# EasyEDA Pro project 64.epro

# Schematic Schematic1
Create Date: 2023-10-18; Page Name: P1; Project Name: 8*8ws2812bdis; Schematic Name: Schematic1; Update Date: 2023-10-18; Company: 嘉立创EDA; Page Size: A4; Version: V1.0
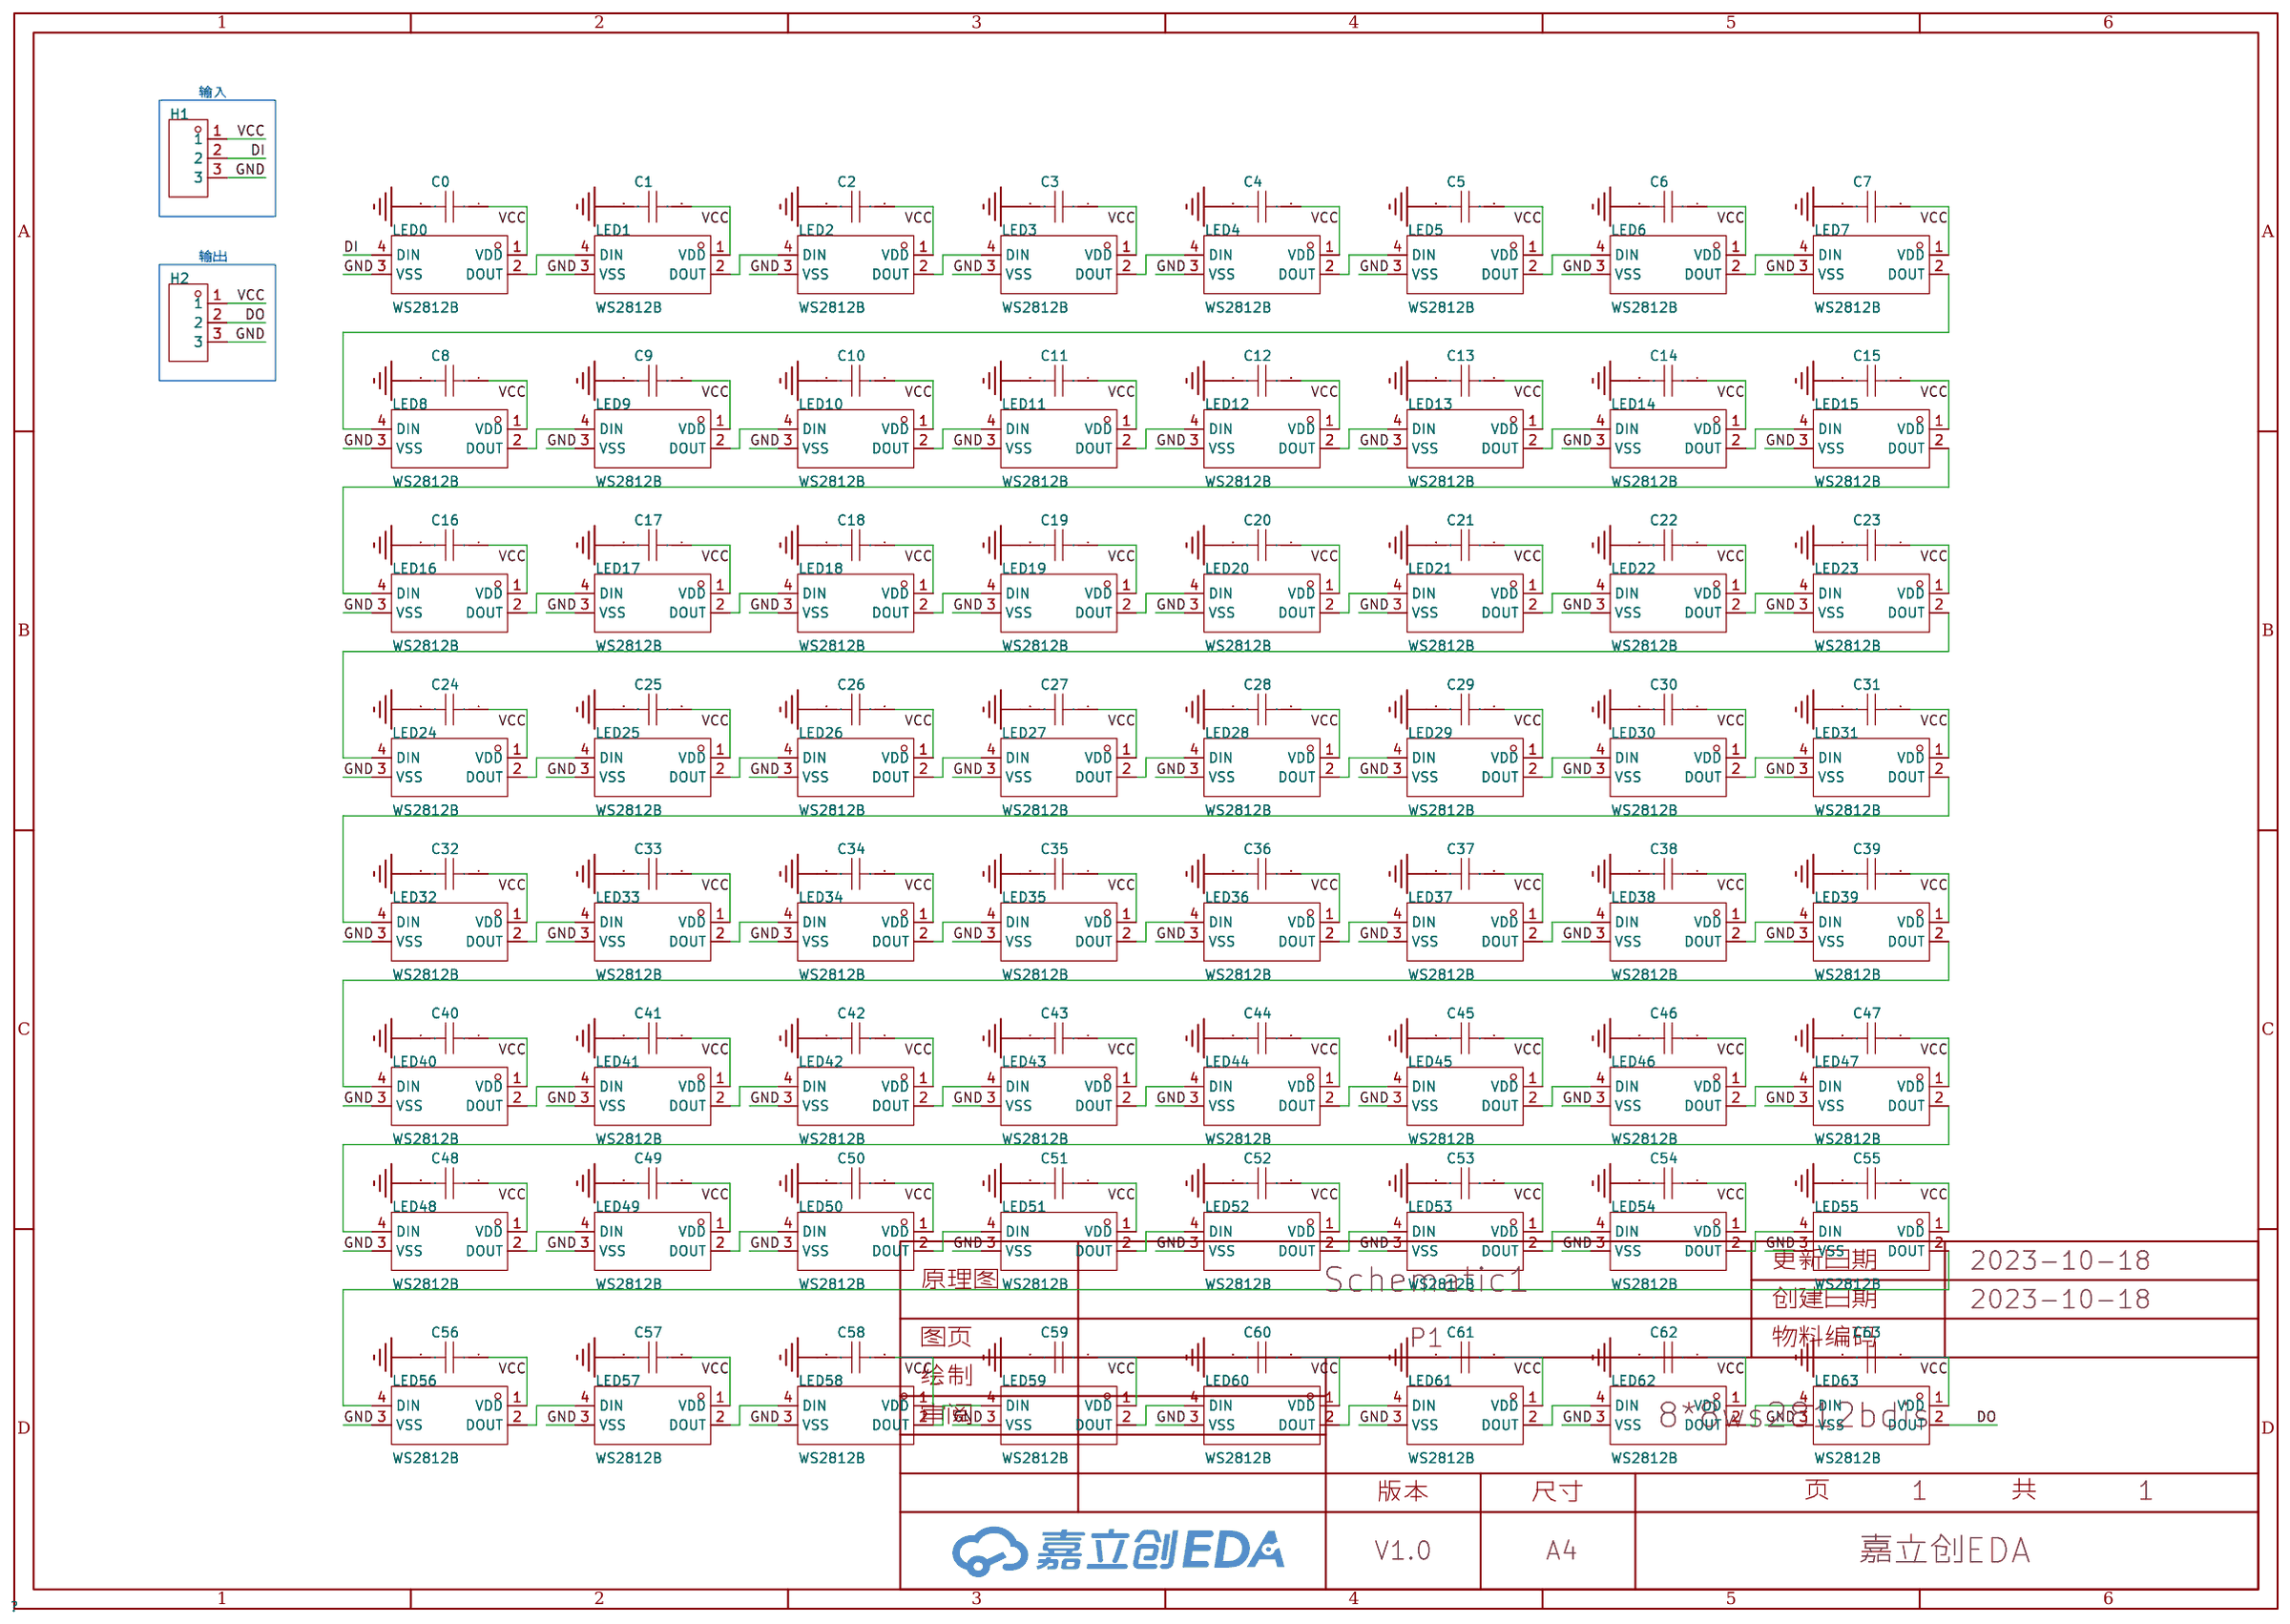
[diagram p0: schematic sheet]

## Parts
C0  0.1uF  [C0603]
C1  0.1uF  [C0603]
C2  0.1uF  [C0603]
C3  0.1uF  [C0603]
C4  0.1uF  [C0603]
C5  0.1uF  [C0603]
C6  0.1uF  [C0603]
C7  0.1uF  [C0603]
C8  0.1uF  [C0603]
C9  0.1uF  [C0603]
C10  0.1uF  [C0603]
C11  0.1uF  [C0603]
C12  0.1uF  [C0603]
C13  0.1uF  [C0603]
C14  0.1uF  [C0603]
C15  0.1uF  [C0603]
C16  0.1uF  [C0603]
C17  0.1uF  [C0603]
C18  0.1uF  [C0603]
C19  0.1uF  [C0603]
C20  0.1uF  [C0603]
C21  0.1uF  [C0603]
C22  0.1uF  [C0603]
C23  0.1uF  [C0603]
C24  0.1uF  [C0603]
C25  0.1uF  [C0603]
C26  0.1uF  [C0603]
C27  0.1uF  [C0603]
C28  0.1uF  [C0603]
C29  0.1uF  [C0603]
C30  0.1uF  [C0603]
C31  0.1uF  [C0603]
C32  0.1uF  [C0603]
C33  0.1uF  [C0603]
C34  0.1uF  [C0603]
C35  0.1uF  [C0603]
C36  0.1uF  [C0603]
C37  0.1uF  [C0603]
C38  0.1uF  [C0603]
C39  0.1uF  [C0603]
C40  0.1uF  [C0603]
C41  0.1uF  [C0603]
C42  0.1uF  [C0603]
C43  0.1uF  [C0603]
C44  0.1uF  [C0603]
C45  0.1uF  [C0603]
C46  0.1uF  [C0603]
C47  0.1uF  [C0603]
C48  0.1uF  [C0603]
C49  0.1uF  [C0603]
C50  0.1uF  [C0603]
C51  0.1uF  [C0603]
C52  0.1uF  [C0603]
C53  0.1uF  [C0603]
C54  0.1uF  [C0603]
C55  0.1uF  [C0603]
C56  0.1uF  [C0603]
C57  0.1uF  [C0603]
C58  0.1uF  [C0603]
C59  0.1uF  [C0603]
C60  0.1uF  [C0603]
C61  0.1uF  [C0603]
C62  0.1uF  [C0603]
C63  0.1uF  [C0603]
H1  -  [HDR-TH_3P-P2.54-V-M]
H2  -  [HDR-TH_3P-P2.54-V-M]
LED0  WS2812B  [LED-SMD_4P-L5.0-W5.0-TL]
LED1  WS2812B  [LED-SMD_4P-L5.0-W5.0-TL]
LED2  WS2812B  [LED-SMD_4P-L5.0-W5.0-TL]
LED3  WS2812B  [LED-SMD_4P-L5.0-W5.0-TL]
LED4  WS2812B  [LED-SMD_4P-L5.0-W5.0-TL]
LED5  WS2812B  [LED-SMD_4P-L5.0-W5.0-TL]
LED6  WS2812B  [LED-SMD_4P-L5.0-W5.0-TL]
LED7  WS2812B  [LED-SMD_4P-L5.0-W5.0-TL]
LED8  WS2812B  [LED-SMD_4P-L5.0-W5.0-TL]
LED9  WS2812B  [LED-SMD_4P-L5.0-W5.0-TL]
LED10  WS2812B  [LED-SMD_4P-L5.0-W5.0-TL]
LED11  WS2812B  [LED-SMD_4P-L5.0-W5.0-TL]
LED12  WS2812B  [LED-SMD_4P-L5.0-W5.0-TL]
LED13  WS2812B  [LED-SMD_4P-L5.0-W5.0-TL]
LED14  WS2812B  [LED-SMD_4P-L5.0-W5.0-TL]
LED15  WS2812B  [LED-SMD_4P-L5.0-W5.0-TL]
LED16  WS2812B  [LED-SMD_4P-L5.0-W5.0-TL]
LED17  WS2812B  [LED-SMD_4P-L5.0-W5.0-TL]
LED18  WS2812B  [LED-SMD_4P-L5.0-W5.0-TL]
LED19  WS2812B  [LED-SMD_4P-L5.0-W5.0-TL]
LED20  WS2812B  [LED-SMD_4P-L5.0-W5.0-TL]
LED21  WS2812B  [LED-SMD_4P-L5.0-W5.0-TL]
LED22  WS2812B  [LED-SMD_4P-L5.0-W5.0-TL]
LED23  WS2812B  [LED-SMD_4P-L5.0-W5.0-TL]
LED24  WS2812B  [LED-SMD_4P-L5.0-W5.0-TL]
LED25  WS2812B  [LED-SMD_4P-L5.0-W5.0-TL]
LED26  WS2812B  [LED-SMD_4P-L5.0-W5.0-TL]
LED27  WS2812B  [LED-SMD_4P-L5.0-W5.0-TL]
LED28  WS2812B  [LED-SMD_4P-L5.0-W5.0-TL]
LED29  WS2812B  [LED-SMD_4P-L5.0-W5.0-TL]
LED30  WS2812B  [LED-SMD_4P-L5.0-W5.0-TL]
LED31  WS2812B  [LED-SMD_4P-L5.0-W5.0-TL]
LED32  WS2812B  [LED-SMD_4P-L5.0-W5.0-TL]
LED33  WS2812B  [LED-SMD_4P-L5.0-W5.0-TL]
LED34  WS2812B  [LED-SMD_4P-L5.0-W5.0-TL]
LED35  WS2812B  [LED-SMD_4P-L5.0-W5.0-TL]
LED36  WS2812B  [LED-SMD_4P-L5.0-W5.0-TL]
LED37  WS2812B  [LED-SMD_4P-L5.0-W5.0-TL]
LED38  WS2812B  [LED-SMD_4P-L5.0-W5.0-TL]
LED39  WS2812B  [LED-SMD_4P-L5.0-W5.0-TL]
LED40  WS2812B  [LED-SMD_4P-L5.0-W5.0-TL]
LED41  WS2812B  [LED-SMD_4P-L5.0-W5.0-TL]
LED42  WS2812B  [LED-SMD_4P-L5.0-W5.0-TL]
LED43  WS2812B  [LED-SMD_4P-L5.0-W5.0-TL]
LED44  WS2812B  [LED-SMD_4P-L5.0-W5.0-TL]
LED45  WS2812B  [LED-SMD_4P-L5.0-W5.0-TL]
LED46  WS2812B  [LED-SMD_4P-L5.0-W5.0-TL]
LED47  WS2812B  [LED-SMD_4P-L5.0-W5.0-TL]
LED48  WS2812B  [LED-SMD_4P-L5.0-W5.0-TL]
LED49  WS2812B  [LED-SMD_4P-L5.0-W5.0-TL]
LED50  WS2812B  [LED-SMD_4P-L5.0-W5.0-TL]
LED51  WS2812B  [LED-SMD_4P-L5.0-W5.0-TL]
LED52  WS2812B  [LED-SMD_4P-L5.0-W5.0-TL]
LED53  WS2812B  [LED-SMD_4P-L5.0-W5.0-TL]
LED54  WS2812B  [LED-SMD_4P-L5.0-W5.0-TL]
LED55  WS2812B  [LED-SMD_4P-L5.0-W5.0-TL]
LED56  WS2812B  [LED-SMD_4P-L5.0-W5.0-TL]
LED57  WS2812B  [LED-SMD_4P-L5.0-W5.0-TL]
LED58  WS2812B  [LED-SMD_4P-L5.0-W5.0-TL]
LED59  WS2812B  [LED-SMD_4P-L5.0-W5.0-TL]
LED60  WS2812B  [LED-SMD_4P-L5.0-W5.0-TL]
LED61  WS2812B  [LED-SMD_4P-L5.0-W5.0-TL]
LED62  WS2812B  [LED-SMD_4P-L5.0-W5.0-TL]
LED63  WS2812B  [LED-SMD_4P-L5.0-W5.0-TL]

## Library data of the parts
C0-C63 = 0603BB104K500NGT: 容值:0.1uF;精度:±10%;额定电压:50V;温度系数:-;; LCSC Part Name: 0.1uF ±10% 50V; Supplier Part: C2168571; Manufacturer: Knowles(楼氏); Supplier Footprint: 0603; JLCPCB Part Class: 扩展库; Datasheet: https://atta.szlcsc.com/upload/public/pdf/source/20210426/55B82DB4A9EC19DEFEE13887341FCC08.pdf; Supplier: LCSC; Tolerance: ±10%; Voltage Rated: 50V
H1 H2 = HDR-M_2.54_1x3P: Supplier Part: C2937625; Supplier Footprint: 插件; JLCPCB Part Class: 扩展库
LED0-LED63 = WS2812B_C9900004137: Supplier Part: C9900004137; Supplier Footprint: LED-4_5050; JLCPCB Part Class: 扩展库; Supplier: LCSC

## Nets
GND: C0.2 C1.2 C2.2 C3.2 C4.2 C5.2 C6.2 C7.2 C8.2 C9.2 C10.2 C11.2 C12.2 C13.2 C14.2 C15.2 C16.2 C17.2 C18.2 C19.2 C20.2 C21.2 C22.2 C23.2 C24.2 C25.2 C26.2 C27.2 C28.2 C29.2 C30.2 C31.2 C32.2 C33.2 C34.2 C35.2 C36.2 C37.2 C38.2 C39.2 C40.2 C41.2 C42.2 C43.2 C44.2 C45.2 C46.2 C47.2 C48.2 C49.2 C50.2 C51.2 C52.2 C53.2 C54.2 C55.2 C56.2 C57.2 C58.2 C59.2 C60.2 C61.2 C62.2 C63.2 H1.3 H2.3 LED0.3(VSS) LED1.3(VSS) LED2.3(VSS) LED3.3(VSS) LED4.3(VSS) LED5.3(VSS) LED6.3(VSS) LED7.3(VSS) LED8.3(VSS) LED9.3(VSS) LED10.3(VSS) LED11.3(VSS) LED12.3(VSS) LED13.3(VSS) LED14.3(VSS) LED15.3(VSS) LED16.3(VSS) LED17.3(VSS) LED18.3(VSS) LED19.3(VSS) LED20.3(VSS) LED21.3(VSS) LED22.3(VSS) LED23.3(VSS) LED24.3(VSS) LED25.3(VSS) LED26.3(VSS) LED27.3(VSS) LED28.3(VSS) LED29.3(VSS) LED30.3(VSS) LED31.3(VSS) LED32.3(VSS) LED33.3(VSS) LED34.3(VSS) LED35.3(VSS) LED36.3(VSS) LED37.3(VSS) LED38.3(VSS) LED39.3(VSS) LED40.3(VSS) LED41.3(VSS) LED42.3(VSS) LED43.3(VSS) LED44.3(VSS) LED45.3(VSS) LED46.3(VSS) LED47.3(VSS) LED48.3(VSS) LED49.3(VSS) LED50.3(VSS) LED51.3(VSS) LED52.3(VSS) LED53.3(VSS) LED54.3(VSS) LED55.3(VSS) LED56.3(VSS) LED57.3(VSS) LED58.3(VSS) LED59.3(VSS) LED60.3(VSS) LED61.3(VSS) LED62.3(VSS) LED63.3(VSS)
VCC: C0.1 C1.1 C2.1 C3.1 C4.1 C5.1 C6.1 C7.1 C8.1 C9.1 C10.1 C11.1 C12.1 C13.1 C14.1 C15.1 C16.1 C17.1 C18.1 C19.1 C20.1 C21.1 C22.1 C23.1 C24.1 C25.1 C26.1 C27.1 C28.1 C29.1 C30.1 C31.1 C32.1 C33.1 C34.1 C35.1 C36.1 C37.1 C38.1 C39.1 C40.1 C41.1 C42.1 C43.1 C44.1 C45.1 C46.1 C47.1 C48.1 C49.1 C50.1 C51.1 C52.1 C53.1 C54.1 C55.1 C56.1 C57.1 C58.1 C59.1 C60.1 C61.1 C62.1 C63.1 H1.1 H2.1 LED0.1(VDD) LED1.1(VDD) LED2.1(VDD) LED3.1(VDD) LED4.1(VDD) LED5.1(VDD) LED6.1(VDD) LED7.1(VDD) LED8.1(VDD) LED9.1(VDD) LED10.1(VDD) LED11.1(VDD) LED12.1(VDD) LED13.1(VDD) LED14.1(VDD) LED15.1(VDD) LED16.1(VDD) LED17.1(VDD) LED18.1(VDD) LED19.1(VDD) LED20.1(VDD) LED21.1(VDD) LED22.1(VDD) LED23.1(VDD) LED24.1(VDD) LED25.1(VDD) LED26.1(VDD) LED27.1(VDD) LED28.1(VDD) LED29.1(VDD) LED30.1(VDD) LED31.1(VDD) LED32.1(VDD) LED33.1(VDD) LED34.1(VDD) LED35.1(VDD) LED36.1(VDD) LED37.1(VDD) LED38.1(VDD) LED39.1(VDD) LED40.1(VDD) LED41.1(VDD) LED42.1(VDD) LED43.1(VDD) LED44.1(VDD) LED45.1(VDD) LED46.1(VDD) LED47.1(VDD) LED48.1(VDD) LED49.1(VDD) LED50.1(VDD) LED51.1(VDD) LED52.1(VDD) LED53.1(VDD) LED54.1(VDD) LED55.1(VDD) LED56.1(VDD) LED57.1(VDD) LED58.1(VDD) LED59.1(VDD) LED60.1(VDD) LED61.1(VDD) LED62.1(VDD) LED63.1(VDD)
DI: H1.2 LED0.4(DIN)
DO: H2.2 LED63.2(DOUT)
Net-(LED0-2): LED0.2(DOUT) LED1.4(DIN)
Net-(LED1-2): LED1.2(DOUT) LED2.4(DIN)
Net-(LED2-2): LED2.2(DOUT) LED3.4(DIN)
Net-(LED3-2): LED3.2(DOUT) LED4.4(DIN)
Net-(LED4-2): LED4.2(DOUT) LED5.4(DIN)
Net-(LED5-2): LED5.2(DOUT) LED6.4(DIN)
Net-(LED6-2): LED6.2(DOUT) LED7.4(DIN)
Net-(LED7-2): LED7.2(DOUT) LED8.4(DIN)
Net-(LED8-2): LED8.2(DOUT) LED9.4(DIN)
Net-(LED9-2): LED9.2(DOUT) LED10.4(DIN)
Net-(LED10-2): LED10.2(DOUT) LED11.4(DIN)
Net-(LED11-2): LED11.2(DOUT) LED12.4(DIN)
Net-(LED12-2): LED12.2(DOUT) LED13.4(DIN)
Net-(LED13-2): LED13.2(DOUT) LED14.4(DIN)
Net-(LED14-2): LED14.2(DOUT) LED15.4(DIN)
Net-(LED15-2): LED15.2(DOUT) LED16.4(DIN)
Net-(LED16-2): LED16.2(DOUT) LED17.4(DIN)
Net-(LED17-2): LED17.2(DOUT) LED18.4(DIN)
Net-(LED18-2): LED18.2(DOUT) LED19.4(DIN)
Net-(LED19-2): LED19.2(DOUT) LED20.4(DIN)
Net-(LED20-2): LED20.2(DOUT) LED21.4(DIN)
Net-(LED21-2): LED21.2(DOUT) LED22.4(DIN)
Net-(LED22-2): LED22.2(DOUT) LED23.4(DIN)
Net-(LED23-2): LED23.2(DOUT) LED24.4(DIN)
Net-(LED24-2): LED24.2(DOUT) LED25.4(DIN)
Net-(LED25-2): LED25.2(DOUT) LED26.4(DIN)
Net-(LED26-2): LED26.2(DOUT) LED27.4(DIN)
Net-(LED27-2): LED27.2(DOUT) LED28.4(DIN)
Net-(LED28-2): LED28.2(DOUT) LED29.4(DIN)
Net-(LED29-2): LED29.2(DOUT) LED30.4(DIN)
Net-(LED30-2): LED30.2(DOUT) LED31.4(DIN)
Net-(LED31-2): LED31.2(DOUT) LED32.4(DIN)
Net-(LED32-2): LED32.2(DOUT) LED33.4(DIN)
Net-(LED33-2): LED33.2(DOUT) LED34.4(DIN)
Net-(LED34-2): LED34.2(DOUT) LED35.4(DIN)
Net-(LED35-2): LED35.2(DOUT) LED36.4(DIN)
Net-(LED36-2): LED36.2(DOUT) LED37.4(DIN)
Net-(LED37-2): LED37.2(DOUT) LED38.4(DIN)
Net-(LED38-2): LED38.2(DOUT) LED39.4(DIN)
Net-(LED39-2): LED39.2(DOUT) LED40.4(DIN)
Net-(LED40-2): LED40.2(DOUT) LED41.4(DIN)
Net-(LED41-2): LED41.2(DOUT) LED42.4(DIN)
Net-(LED42-2): LED42.2(DOUT) LED43.4(DIN)
Net-(LED43-2): LED43.2(DOUT) LED44.4(DIN)
Net-(LED44-2): LED44.2(DOUT) LED45.4(DIN)
Net-(LED45-2): LED45.2(DOUT) LED46.4(DIN)
Net-(LED46-2): LED46.2(DOUT) LED47.4(DIN)
Net-(LED47-2): LED47.2(DOUT) LED48.4(DIN)
Net-(LED48-2): LED48.2(DOUT) LED49.4(DIN)
Net-(LED49-2): LED49.2(DOUT) LED50.4(DIN)
Net-(LED50-2): LED50.2(DOUT) LED51.4(DIN)
Net-(LED51-2): LED51.2(DOUT) LED52.4(DIN)
Net-(LED52-2): LED52.2(DOUT) LED53.4(DIN)
Net-(LED53-2): LED53.2(DOUT) LED54.4(DIN)
Net-(LED54-2): LED54.2(DOUT) LED55.4(DIN)
Net-(LED55-2): LED55.2(DOUT) LED56.4(DIN)
Net-(LED56-2): LED56.2(DOUT) LED57.4(DIN)
Net-(LED57-2): LED57.2(DOUT) LED58.4(DIN)
Net-(LED58-2): LED58.2(DOUT) LED59.4(DIN)
Net-(LED59-2): LED59.2(DOUT) LED60.4(DIN)
Net-(LED60-2): LED60.2(DOUT) LED61.4(DIN)
Net-(LED61-2): LED61.2(DOUT) LED62.4(DIN)
Net-(LED62-2): LED62.2(DOUT) LED63.4(DIN)

## Notes on the sheet
- 输入
- 输出

# Board PCB1_1
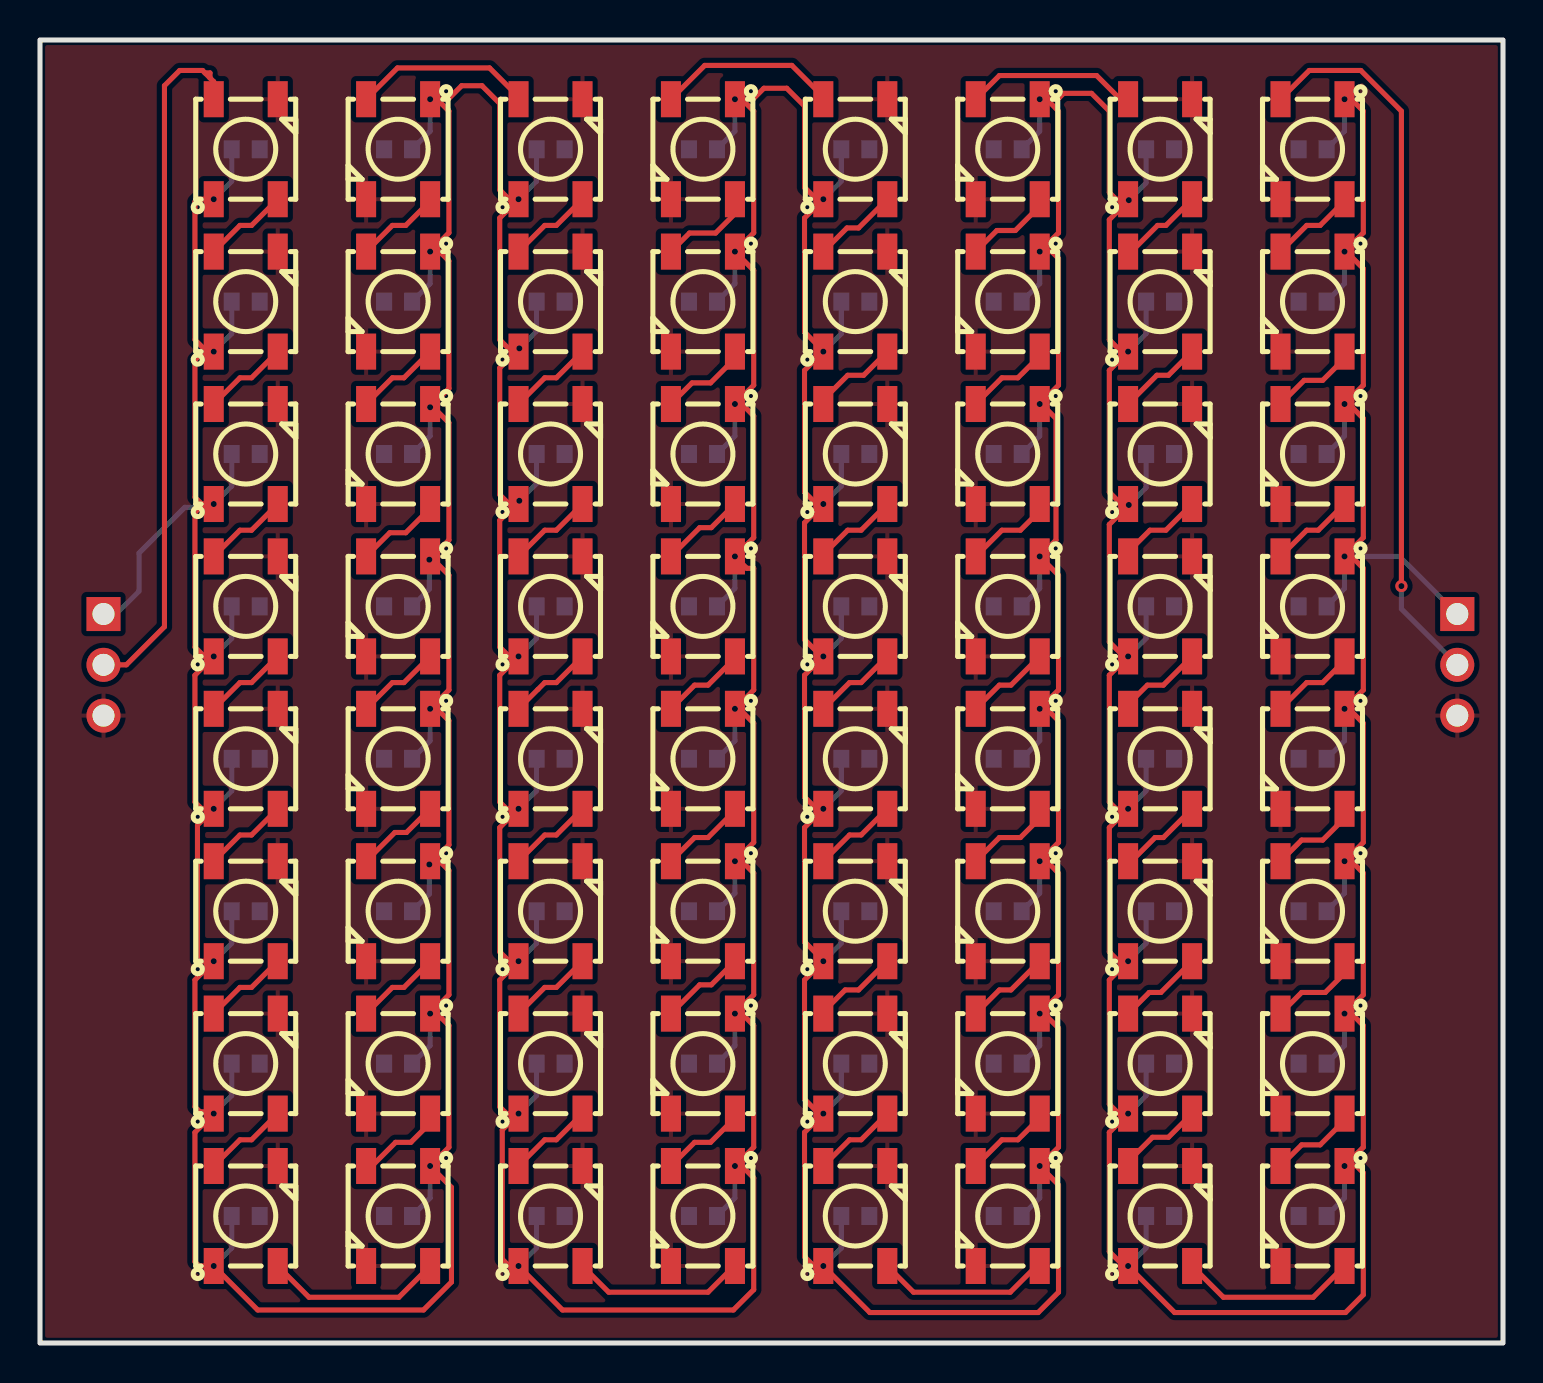
[diagram p1: board, top side]
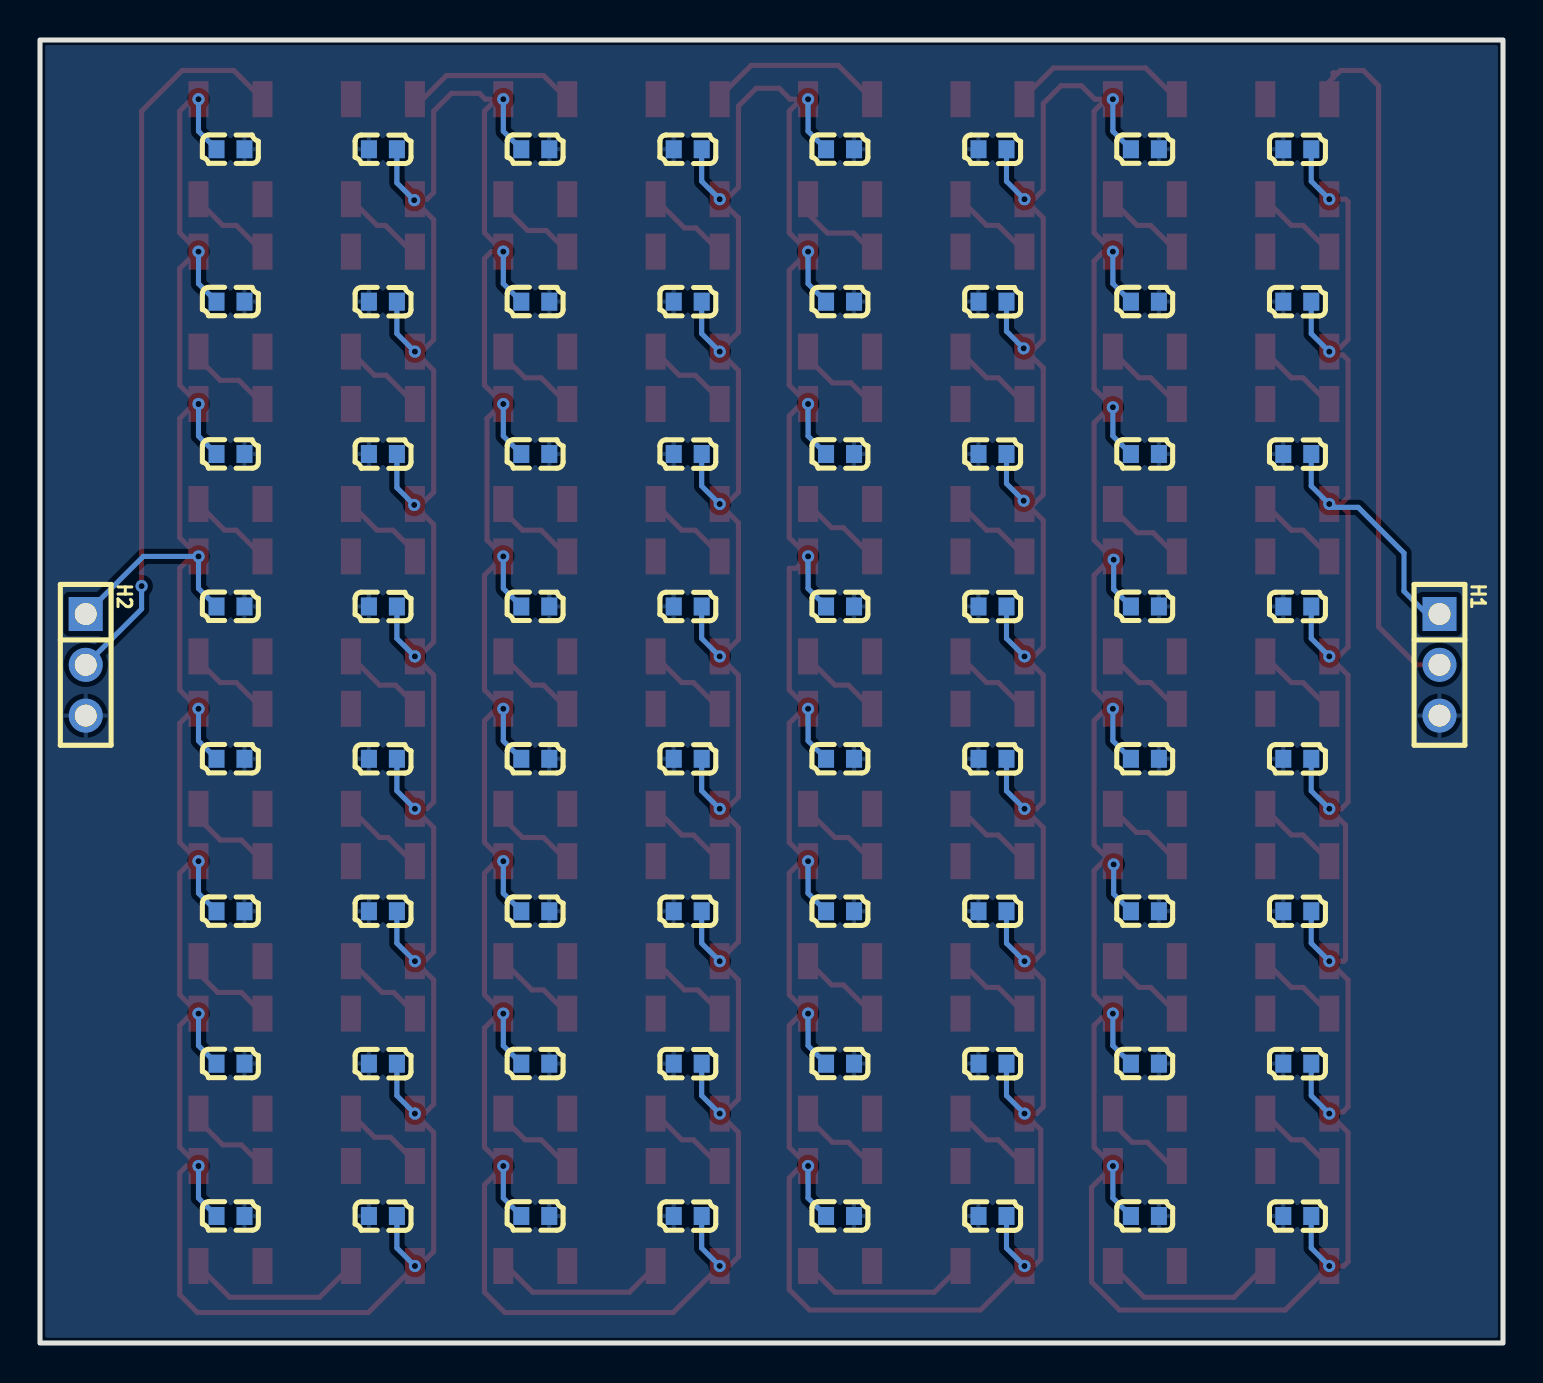
[diagram p2: board, bottom side, seen from below]

Outline 73.15 x 65.15 mm; copper layers: Top Layer, Bottom Layer. Coordinates in mm from the lower left corner of the outline.
Outline path: rectangle 0,65.15 73.15,0
Stack: Top Layer 0.035mm / Dielectric1 1.51mm FR4 er 4.5 / Bottom Layer 0.035mm

## Design rules (mm)
template: JLCPCB Capability(Two Layers Board)
spacing copperThickness1oz (default): track to track 0.102, other pairs 0.152 to 0.3
spacing copperThickness2oz: track to track 0.203, other pairs 0.152 to 0.3
track width copperThickness1oz (default): min 0.127, default 0.254, max 2.54
track width copperThickness2oz: min 0.203, default 0.254, max 2.54
differential pair differentialPair (default): width min 0.127, default 0.254, max 2.54; gap min 0.152, default 0.152
via viaSize (default): diameter min 0.5, default 0.61, max 10; hole min 0.3, default 0.305, max 6.3

## Placement (name value [footprint] x y rotation side)
C0  0.1uF  [C0603]  10.29 6.35 0 bottom
C1  0.1uF  [C0603]  10.29 13.97 0 bottom
C2  0.1uF  [C0603]  10.29 21.59 0 bottom
C3  0.1uF  [C0603]  10.29 29.21 0 bottom
C4  0.1uF  [C0603]  10.29 36.83 0 bottom
C5  0.1uF  [C0603]  10.29 44.45 0 bottom
C6  0.1uF  [C0603]  10.29 59.69 0 bottom
C7  0.1uF  [C0603]  10.29 52.07 0 bottom
C8  0.1uF  [C0603]  17.91 6.35 180 bottom
C9  0.1uF  [C0603]  17.91 13.97 180 bottom
C10  0.1uF  [C0603]  17.91 21.59 180 bottom
C11  0.1uF  [C0603]  17.91 29.21 180 bottom
C12  0.1uF  [C0603]  17.91 36.83 180 bottom
C13  0.1uF  [C0603]  17.91 44.45 180 bottom
C14  0.1uF  [C0603]  17.91 52.07 180 bottom
C15  0.1uF  [C0603]  17.91 59.69 180 bottom
C16  0.1uF  [C0603]  25.53 6.35 0 bottom
C17  0.1uF  [C0603]  25.53 13.97 0 bottom
C18  0.1uF  [C0603]  25.53 21.59 0 bottom
C19  0.1uF  [C0603]  25.53 29.21 0 bottom
C20  0.1uF  [C0603]  25.53 36.83 0 bottom
C21  0.1uF  [C0603]  25.53 44.45 0 bottom
C22  0.1uF  [C0603]  25.53 52.07 0 bottom
C23  0.1uF  [C0603]  25.53 59.69 0 bottom
C24  0.1uF  [C0603]  33.15 36.83 180 bottom
C25  0.1uF  [C0603]  33.15 6.35 180 bottom
C26  0.1uF  [C0603]  33.15 13.97 180 bottom
C27  0.1uF  [C0603]  33.15 21.59 180 bottom
C28  0.1uF  [C0603]  33.15 29.21 180 bottom
C29  0.1uF  [C0603]  33.15 44.45 180 bottom
C30  0.1uF  [C0603]  33.15 52.07 180 bottom
C31  0.1uF  [C0603]  33.15 59.69 180 bottom
C32  0.1uF  [C0603]  40.77 6.35 0 bottom
C33  0.1uF  [C0603]  40.77 13.97 0 bottom
C34  0.1uF  [C0603]  40.77 21.59 0 bottom
C35  0.1uF  [C0603]  40.77 29.21 0 bottom
C36  0.1uF  [C0603]  40.77 36.83 0 bottom
C37  0.1uF  [C0603]  40.77 44.45 0 bottom
C38  0.1uF  [C0603]  40.77 52.07 0 bottom
C39  0.1uF  [C0603]  40.77 59.69 0 bottom
C40  0.1uF  [C0603]  48.39 6.35 180 bottom
C41  0.1uF  [C0603]  48.39 13.97 180 bottom
C42  0.1uF  [C0603]  48.39 21.59 180 bottom
C43  0.1uF  [C0603]  48.39 29.21 180 bottom
C44  0.1uF  [C0603]  48.39 36.83 180 bottom
C45  0.1uF  [C0603]  48.39 44.45 180 bottom
C46  0.1uF  [C0603]  48.39 52.07 180 bottom
C47  0.1uF  [C0603]  48.39 59.69 180 bottom
C48  0.1uF  [C0603]  56.01 6.35 0 bottom
C49  0.1uF  [C0603]  56.01 13.97 0 bottom
C50  0.1uF  [C0603]  56.01 21.59 0 bottom
C51  0.1uF  [C0603]  56.01 29.21 0 bottom
C52  0.1uF  [C0603]  56.01 36.83 0 bottom
C53  0.1uF  [C0603]  56.01 44.45 0 bottom
C54  0.1uF  [C0603]  56.01 52.07 0 bottom
C55  0.1uF  [C0603]  56.01 59.69 0 bottom
C56  0.1uF  [C0603]  63.63 6.35 180 bottom
C57  0.1uF  [C0603]  63.63 13.97 180 bottom
C58  0.1uF  [C0603]  63.63 21.59 180 bottom
C59  0.1uF  [C0603]  63.63 29.21 180 bottom
C60  0.1uF  [C0603]  63.63 36.83 180 bottom
C61  0.1uF  [C0603]  63.63 44.45 180 bottom
C62  0.1uF  [C0603]  63.63 52.07 180 bottom
C63  0.1uF  [C0603]  63.63 59.69 180 bottom
H1  -  [HDR-TH_3P-P2.54-V-M]  3.18 33.91 270 bottom
H2  -  [HDR-TH_3P-P2.54-V-M]  70.87 33.91 270 bottom
LED0  WS2812B  [LED-SMD_4P-L5.0-W5.0-TL]  10.29 59.69 90 top
LED1  WS2812B  [LED-SMD_4P-L5.0-W5.0-TL]  10.29 52.07 90 top
LED2  WS2812B  [LED-SMD_4P-L5.0-W5.0-TL]  10.29 44.45 90 top
LED3  WS2812B  [LED-SMD_4P-L5.0-W5.0-TL]  10.29 36.83 90 top
LED4  WS2812B  [LED-SMD_4P-L5.0-W5.0-TL]  10.29 29.21 90 top
LED5  WS2812B  [LED-SMD_4P-L5.0-W5.0-TL]  10.29 21.59 90 top
LED6  WS2812B  [LED-SMD_4P-L5.0-W5.0-TL]  10.29 13.97 90 top
LED7  WS2812B  [LED-SMD_4P-L5.0-W5.0-TL]  10.29 6.35 90 top
LED8  WS2812B  [LED-SMD_4P-L5.0-W5.0-TL]  17.91 6.35 270 top
LED9  WS2812B  [LED-SMD_4P-L5.0-W5.0-TL]  17.91 13.97 270 top
LED10  WS2812B  [LED-SMD_4P-L5.0-W5.0-TL]  17.91 21.59 270 top
LED11  WS2812B  [LED-SMD_4P-L5.0-W5.0-TL]  17.91 29.21 270 top
LED12  WS2812B  [LED-SMD_4P-L5.0-W5.0-TL]  17.91 36.83 270 top
LED13  WS2812B  [LED-SMD_4P-L5.0-W5.0-TL]  17.91 44.45 270 top
LED14  WS2812B  [LED-SMD_4P-L5.0-W5.0-TL]  17.91 52.07 270 top
LED15  WS2812B  [LED-SMD_4P-L5.0-W5.0-TL]  17.91 59.69 270 top
LED16  WS2812B  [LED-SMD_4P-L5.0-W5.0-TL]  25.53 59.69 90 top
LED17  WS2812B  [LED-SMD_4P-L5.0-W5.0-TL]  25.53 52.07 90 top
LED18  WS2812B  [LED-SMD_4P-L5.0-W5.0-TL]  25.53 44.45 90 top
LED19  WS2812B  [LED-SMD_4P-L5.0-W5.0-TL]  25.53 36.83 90 top
LED20  WS2812B  [LED-SMD_4P-L5.0-W5.0-TL]  25.53 29.21 90 top
LED21  WS2812B  [LED-SMD_4P-L5.0-W5.0-TL]  25.53 21.59 90 top
LED22  WS2812B  [LED-SMD_4P-L5.0-W5.0-TL]  25.53 13.97 90 top
LED23  WS2812B  [LED-SMD_4P-L5.0-W5.0-TL]  25.53 6.35 90 top
LED24  WS2812B  [LED-SMD_4P-L5.0-W5.0-TL]  33.15 6.35 270 top
LED25  WS2812B  [LED-SMD_4P-L5.0-W5.0-TL]  33.15 13.97 270 top
LED26  WS2812B  [LED-SMD_4P-L5.0-W5.0-TL]  33.15 21.59 270 top
LED27  WS2812B  [LED-SMD_4P-L5.0-W5.0-TL]  33.15 29.21 270 top
LED28  WS2812B  [LED-SMD_4P-L5.0-W5.0-TL]  33.15 36.83 270 top
LED29  WS2812B  [LED-SMD_4P-L5.0-W5.0-TL]  33.15 44.45 270 top
LED30  WS2812B  [LED-SMD_4P-L5.0-W5.0-TL]  33.15 52.07 270 top
LED31  WS2812B  [LED-SMD_4P-L5.0-W5.0-TL]  33.15 59.69 270 top
LED32  WS2812B  [LED-SMD_4P-L5.0-W5.0-TL]  40.77 59.69 90 top
LED33  WS2812B  [LED-SMD_4P-L5.0-W5.0-TL]  40.77 52.07 90 top
LED34  WS2812B  [LED-SMD_4P-L5.0-W5.0-TL]  40.77 44.45 90 top
LED35  WS2812B  [LED-SMD_4P-L5.0-W5.0-TL]  40.77 36.83 90 top
LED36  WS2812B  [LED-SMD_4P-L5.0-W5.0-TL]  40.77 29.21 90 top
LED37  WS2812B  [LED-SMD_4P-L5.0-W5.0-TL]  40.77 21.59 90 top
LED38  WS2812B  [LED-SMD_4P-L5.0-W5.0-TL]  40.77 13.97 90 top
LED39  WS2812B  [LED-SMD_4P-L5.0-W5.0-TL]  40.77 6.35 90 top
LED40  WS2812B  [LED-SMD_4P-L5.0-W5.0-TL]  48.39 6.35 270 top
LED41  WS2812B  [LED-SMD_4P-L5.0-W5.0-TL]  48.39 13.97 270 top
LED42  WS2812B  [LED-SMD_4P-L5.0-W5.0-TL]  48.39 21.59 270 top
LED43  WS2812B  [LED-SMD_4P-L5.0-W5.0-TL]  48.39 29.21 270 top
LED44  WS2812B  [LED-SMD_4P-L5.0-W5.0-TL]  48.39 36.83 270 top
LED45  WS2812B  [LED-SMD_4P-L5.0-W5.0-TL]  48.39 44.45 270 top
LED46  WS2812B  [LED-SMD_4P-L5.0-W5.0-TL]  48.39 52.07 270 top
LED47  WS2812B  [LED-SMD_4P-L5.0-W5.0-TL]  48.39 59.69 270 top
LED48  WS2812B  [LED-SMD_4P-L5.0-W5.0-TL]  56.01 59.69 90 top
LED49  WS2812B  [LED-SMD_4P-L5.0-W5.0-TL]  56.01 52.07 90 top
LED50  WS2812B  [LED-SMD_4P-L5.0-W5.0-TL]  56.01 44.45 90 top
LED51  WS2812B  [LED-SMD_4P-L5.0-W5.0-TL]  56.01 36.83 90 top
LED52  WS2812B  [LED-SMD_4P-L5.0-W5.0-TL]  56.01 29.21 90 top
LED53  WS2812B  [LED-SMD_4P-L5.0-W5.0-TL]  56.01 21.59 90 top
LED54  WS2812B  [LED-SMD_4P-L5.0-W5.0-TL]  56.01 13.97 90 top
LED55  WS2812B  [LED-SMD_4P-L5.0-W5.0-TL]  56.01 6.35 90 top
LED56  WS2812B  [LED-SMD_4P-L5.0-W5.0-TL]  63.63 6.35 270 top
LED57  WS2812B  [LED-SMD_4P-L5.0-W5.0-TL]  63.63 13.97 270 top
LED58  WS2812B  [LED-SMD_4P-L5.0-W5.0-TL]  63.63 21.59 270 top
LED59  WS2812B  [LED-SMD_4P-L5.0-W5.0-TL]  63.63 29.21 270 top
LED60  WS2812B  [LED-SMD_4P-L5.0-W5.0-TL]  63.63 36.83 270 top
LED61  WS2812B  [LED-SMD_4P-L5.0-W5.0-TL]  63.63 44.45 270 top
LED62  WS2812B  [LED-SMD_4P-L5.0-W5.0-TL]  63.63 52.07 270 top
LED63  WS2812B  [LED-SMD_4P-L5.0-W5.0-TL]  63.63 59.69 270 top

## Footprints (pads in the part's own frame, mm; a bottom-side part is the same pattern mirrored in y, then rotated)
C0603
  rect 0.8x0.9 smd: 1(-0.7,0) 2(0.7,0)
HDR-TH_3P-P2.54-V-M
  rect 1.7x1.7 hole 1.1: 1(-2.54,0)
  round 1.7 hole 1.1: 2(0,0) 3(2.54,0)
LED-SMD_4P-L5.0-W5.0-TL
  rect 1.8x1 smd: 1(-2.5,1.6) 2(-2.5,-1.6) 3(2.5,-1.6) 4(2.5,1.6)

## Nets
GND: C0.2 C1.2 C2.2 C3.2 C4.2 C5.2 C6.2 C7.2 C8.2 C9.2 C10.2 C11.2 C12.2 C13.2 C14.2 C15.2 C16.2 C17.2 C18.2 C19.2 C20.2 C21.2 C22.2 C23.2 C24.2 C25.2 C26.2 C27.2 C28.2 C29.2 C30.2 C31.2 C32.2 C33.2 C34.2 C35.2 C36.2 C37.2 C38.2 C39.2 C40.2 C41.2 C42.2 C43.2 C44.2 C45.2 C46.2 C47.2 C48.2 C49.2 C50.2 C51.2 C52.2 C53.2 C54.2 C55.2 C56.2 C57.2 C58.2 C59.2 C60.2 C61.2 C62.2 C63.2 H1.3 H2.3 LED0.3 LED1.3 LED2.3 LED3.3 LED4.3 LED5.3 LED6.3 LED7.3 LED8.3 LED9.3 LED10.3 LED11.3 LED12.3 LED13.3 LED14.3 LED15.3 LED16.3 LED17.3 LED18.3 LED19.3 LED20.3 LED21.3 LED22.3 LED23.3 LED24.3 LED25.3 LED26.3 LED27.3 LED28.3 LED29.3 LED30.3 LED31.3 LED32.3 LED33.3 LED34.3 LED35.3 LED36.3 LED37.3 LED38.3 LED39.3 LED40.3 LED41.3 LED42.3 LED43.3 LED44.3 LED45.3 LED46.3 LED47.3 LED48.3 LED49.3 LED50.3 LED51.3 LED52.3 LED53.3 LED54.3 LED55.3 LED56.3 LED57.3 LED58.3 LED59.3 LED60.3 LED61.3 LED62.3 LED63.3
VCC: C0.1 C1.1 C2.1 C3.1 C4.1 C5.1 C6.1 C7.1 C8.1 C9.1 C10.1 C11.1 C12.1 C13.1 C14.1 C15.1 C16.1 C17.1 C18.1 C19.1 C20.1 C21.1 C22.1 C23.1 C24.1 C25.1 C26.1 C27.1 C28.1 C29.1 C30.1 C31.1 C32.1 C33.1 C34.1 C35.1 C36.1 C37.1 C38.1 C39.1 C40.1 C41.1 C42.1 C43.1 C44.1 C45.1 C46.1 C47.1 C48.1 C49.1 C50.1 C51.1 C52.1 C53.1 C54.1 C55.1 C56.1 C57.1 C58.1 C59.1 C60.1 C61.1 C62.1 C63.1 H1.1 H2.1 LED0.1 LED1.1 LED2.1 LED3.1 LED4.1 LED5.1 LED6.1 LED7.1 LED8.1 LED9.1 LED10.1 LED11.1 LED12.1 LED13.1 LED14.1 LED15.1 LED16.1 LED17.1 LED18.1 LED19.1 LED20.1 LED21.1 LED22.1 LED23.1 LED24.1 LED25.1 LED26.1 LED27.1 LED28.1 LED29.1 LED30.1 LED31.1 LED32.1 LED33.1 LED34.1 LED35.1 LED36.1 LED37.1 LED38.1 LED39.1 LED40.1 LED41.1 LED42.1 LED43.1 LED44.1 LED45.1 LED46.1 LED47.1 LED48.1 LED49.1 LED50.1 LED51.1 LED52.1 LED53.1 LED54.1 LED55.1 LED56.1 LED57.1 LED58.1 LED59.1 LED60.1 LED61.1 LED62.1 LED63.1
DI: H1.2 LED0.4
DO: H2.2 LED63.2
$1N808: LED0.2 LED1.4
$1N911: LED1.2 LED2.4
$1N1014: LED2.2 LED3.4
$1N1399: LED3.2 LED4.4
$1N1408: LED4.2 LED5.4
$1N1417: LED5.2 LED6.4
$1N1426: LED6.2 LED7.4
$1N2109: LED8.2 LED9.4
$1N2122: LED9.2 LED10.4
$1N2135: LED10.2 LED11.4
$1N2175: LED11.2 LED12.4
$1N2179: LED12.2 LED13.4
$1N2183: LED13.2 LED14.4
$1N2187: LED14.2 LED15.4
$1N2875: LED16.2 LED17.4
$1N2888: LED17.2 LED18.4
$1N2901: LED18.2 LED19.4
$1N2941: LED19.2 LED20.4
$1N2945: LED20.2 LED21.4
$1N2949: LED21.2 LED22.4
$1N2953: LED22.2 LED23.4
$1N3641: LED24.2 LED25.4
$1N3654: LED25.2 LED26.4
$1N3667: LED26.2 LED27.4
$1N3707: LED27.2 LED28.4
$1N3711: LED28.2 LED29.4
$1N3715: LED29.2 LED30.4
$1N3719: LED30.2 LED31.4
$1N4407: LED32.2 LED33.4
$1N4420: LED33.2 LED34.4
$1N4433: LED34.2 LED35.4
$1N4473: LED35.2 LED36.4
$1N4477: LED36.2 LED37.4
$1N4481: LED37.2 LED38.4
$1N4485: LED38.2 LED39.4
$1N5173: LED40.2 LED41.4
$1N5186: LED41.2 LED42.4
$1N5199: LED42.2 LED43.4
$1N5239: LED43.2 LED44.4
$1N5243: LED44.2 LED45.4
$1N5247: LED45.2 LED46.4
$1N5251: LED46.2 LED47.4
$1N5939: LED48.2 LED49.4
$1N5952: LED49.2 LED50.4
$1N5965: LED50.2 LED51.4
$1N6005: LED51.2 LED52.4
$1N6009: LED52.2 LED53.4
$1N6013: LED53.2 LED54.4
$1N6017: LED54.2 LED55.4
$1N6705: LED56.2 LED57.4
$1N6718: LED57.2 LED58.4
$1N6731: LED58.2 LED59.4
$1N6771: LED59.2 LED60.4
$1N6775: LED60.2 LED61.4
$1N6779: LED61.2 LED62.4
$1N6783: LED62.2 LED63.4
$1N6797: LED7.2 LED8.4
$1N6803: LED15.2 LED16.4
$1N6809: LED23.2 LED24.4
$1N6815: LED31.2 LED32.4
$1N6821: LED39.2 LED40.4
$1N6832: LED47.2 LED48.4
$1N6838: LED55.2 LED56.4

## Via types
v1: diameter 0.61, hole 0.305, Top Layer to Bottom Layer, 65 vias

## Routing (per net, layer and track width the routed paths; a pad name or vN(x,y) marks a point on that pad's centre or on a via; arc(x,y) is an arc through that point)
VCC: length 788.6
  Top Layer w0.254: 23.8,49.57 LED17.1 ; 23.8,49.57 23.58,49.57 22.99,50.16 22.99,56.25 v1(23.93,57.19) 23.46,57.19 22.99,57.66 22.99,61.98 22.1,62.86 21.08,62.86 20.41,62.19 19.85,62.19 ; 23.8,49.57 22.99,48.75 22.99,42.42 23.46,41.95 23.8,41.95 ; 23.8,49.57 v1(23.97,49.73) ; 35.09,62.19 35.69,61.59 35.69,55.51 v1(34.75,54.57) 35.69,53.63 35.69,47.89 v1(34.75,46.95) 35.09,46.95 35.69,46.36 35.69,40.27 v1(34.75,39.33) 35.34,38.73 35.69,38.73 35.69,32.65 v1(34.75,31.71) 34.97,31.71 35.69,30.99 35.69,25.03 v1(34.75,24.09) 35.09,24.09 35.69,23.5 35.69,17.41 v1(34.75,16.47) 35.09,16.47 35.69,15.88 35.69,9.79 v1(34.75,8.85) 35.09,8.85 35.69,8.25 35.69,2.67 34.67,1.65 26.13,1.65 v1(23.93,3.85) 23.46,3.85 23.11,4.19 23.11,10.66 v1(23.93,11.47) 23.33,11.47 22.99,11.81 22.99,18.15 v1(23.93,19.09) 23.46,19.09 22.99,19.56 22.99,25.77 v1(23.93,26.71) 23.33,26.71 22.99,27.05 22.99,33.39 v1(23.93,34.33) 23.46,34.33 22.99,34.8 22.99,41.13 23.8,41.95 ; 35.09,62.19 v1(34.75,62.19) ; 35.09,62.19 35.65,62.19 36.19,62.74 37.34,62.74 38.23,61.85 38.23,57.78 38.82,57.19 v1(39.17,57.19) 38.23,56.25 38.23,50.55 39.17,49.61 v1(39.17,49.57) 38.23,48.63 38.23,42.55 38.82,41.95 v1(39.17,41.95) 38.23,41.01 38.23,35.18 39.08,34.33 v1(39.17,34.33) 38.23,33.39 38.23,27.3 38.82,26.71 v1(39.17,26.71) 38.23,25.77 38.23,20.07 39.17,19.13 v1(39.17,19.09) 38.23,18.15 38.23,12.19 38.95,11.47 v1(39.17,11.47) 38.23,10.53 38.23,4.32 38.69,3.85 v1(39.17,3.85) 41.49,1.52 49.91,1.52 50.93,2.54 50.93,7.91 v1(49.99,8.85) 50.93,9.79 50.93,15.75 50.21,16.47 v1(49.99,16.47) 50.93,17.41 50.93,23.5 50.33,24.09 v1(49.99,24.09) 50.93,25.03 50.93,31.11 50.33,31.71 v1(49.99,31.71) 50.93,32.65 50.93,38.39 v1(49.99,39.33) 50.8,40.14 50.8,46.23 50.08,46.95 v1(49.99,46.95) 50.93,47.89 50.93,54.23 50.59,54.57 v1(49.99,54.57) 50.93,55.51 50.93,61.59 50.33,62.19 ; 23.8,41.95 v1(23.97,42.11) ; 23.8,41.95 LED18.1 ; 19.57,39.27 20.45,40.15 20.45,46.01 19.59,46.87 ; 19.57,39.27 20.45,38.39 20.45,32.65 v1(19.51,31.71) 19.85,31.71 20.45,31.11 20.45,24.91 19.63,24.09 ; 19.57,39.27 LED12.1 ; 19.57,39.27 v1(19.47,39.17) ; v1(19.51,46.79) 19.59,46.87 ; 19.59,46.87 LED13.1 ; 19.59,46.87 20.45,47.73 20.45,54.1 19.98,54.57 v1(19.51,54.57) 20.45,55.51 20.45,61.59 19.85,62.19 ; LED48.1 53.81,57.19 53.47,57.53 53.47,61.59 52.58,62.48 51.18,62.48 50.89,62.19 50.33,62.19 ; v1(54.44,41.9) 53.47,40.93 53.47,35.05 54.19,34.33 v1(54.41,34.33) 53.47,33.39 53.47,27.05 53.81,26.71 v1(54.41,26.71) 53.47,25.77 53.47,19.56 53.94,19.09 v1(54.41,19.09) 53.47,18.15 53.47,11.94 53.94,11.47 v1(54.41,11.47) 53.47,10.53 53.47,4.57 54.19,3.85 v1(54.41,3.85) 56.73,1.52 65.28,1.52 66.17,2.41 66.17,8.51 65.83,8.85 v1(65.23,8.85) 66.17,9.79 66.17,15.88 65.57,16.47 v1(65.23,16.47) 66.17,17.41 66.17,23.5 65.57,24.09 v1(65.23,24.09) 66.17,25.03 66.17,30.99 65.44,31.71 v1(65.23,31.71) 66.17,32.65 66.17,38.73 65.57,39.33 v1(65.23,39.33) 66.17,40.27 66.17,46.23 65.44,46.95 v1(65.23,46.95) 66.17,47.89 66.17,53.72 65.32,54.57 v1(65.23,54.57) 66.17,55.51 66.17,61.59 65.57,62.19 v1(65.23,62.19) ; 19.85,62.19 v1(19.51,62.19) ; 50.33,62.19 v1(49.99,62.19) ; v1(54.44,57.14) 53.47,56.17 53.47,50.16 54.06,49.57 v1(54.41,49.57) 53.47,48.63 53.47,42.55 54.06,41.95 LED50.1 ; 19.63,24.09 LED10.1 ; 19.63,24.09 v1(19.47,23.93) ; 19.63,24.09 19.98,24.09 20.45,23.62 20.45,17.41 v1(19.51,16.47) 19.72,16.26 20.07,16.26 20.45,15.88 20.45,9.79 v1(19.51,8.85) 20.57,7.78 20.57,3.05 19.18,1.65 10.89,1.65 v1(8.69,3.85) 7.96,3.85 7.75,4.06 7.75,10.53 v1(8.69,11.47) 8.6,11.56 8,11.56 7.75,11.81 7.75,18.15 v1(8.69,19.09) 7.96,19.09 7.87,19.18 7.87,25.9 v1(8.69,26.71) 8.09,26.71 7.75,27.05 7.75,33.39 v1(8.69,34.33) 8.22,34.33 7.75,34.8 7.75,41.53 8,41.78 8.52,41.78 v1(8.69,41.95) 8.09,41.95 7.75,42.29 7.75,49.15 8,49.4 8.52,49.4 v1(8.69,49.57) 8.34,49.57 7.75,50.16 7.75,57.06 7.87,57.19 v1(8.69,57.19)
  Bottom Layer w0.254: v1(49.99,62.19) 49.99,60.59 C47.1 ; v1(49.99,16.47) 49.99,14.87 C41.1 ; v1(54.41,3.85) 55.31,4.75 C48.1 ; v1(65.23,16.47) 65.23,14.87 C57.1 ; v1(23.93,3.85) 24.83,4.75 C16.1 ; C36.1 40.07,35.23 v1(39.17,34.33) ; C56.1 65.23,7.25 v1(65.23,8.85) ; v1(34.75,24.09) 34.75,22.49 C27.1 ; v1(54.44,57.14) 55.31,58.01 C55.1 ; C58.1 65.23,22.49 v1(65.23,24.09) ; C22.1 24.83,50.59 v1(23.97,49.73) ; C43.1 49.99,30.11 v1(49.99,31.71) ; v1(34.75,8.85) 34.75,7.25 C25.1 ; v1(8.69,26.71) 9.59,27.61 C3.1 ; C42.1 49.99,22.49 v1(49.99,24.09) ; C60.1 65.23,37.73 v1(65.23,39.33) 67.99,39.33 H2.1 ; C28.1 34.75,30.11 v1(34.75,31.71) ; v1(19.47,39.17) 19.47,37.69 C12.1 ; C1.1 9.59,12.37 v1(8.69,11.47) ; C10.1 19.47,22.45 v1(19.47,23.93) ; v1(49.99,39.33) 49.99,37.73 C44.1 ; C62.1 65.23,52.97 v1(65.23,54.57) ; C4.1 9.59,35.23 v1(8.69,34.33) ; C61.1 65.23,45.35 v1(65.23,46.95) ; v1(19.51,62.19) 19.51,60.59 C15.1 ; v1(19.51,16.47) 19.51,14.87 C9.1 ; v1(49.99,46.95) 49.99,45.35 C45.1 ; C19.1 24.83,27.61 v1(23.93,26.71) ; C39.1 40.07,58.09 v1(39.17,57.19) ; v1(49.99,54.57) 49.99,52.97 C46.1 ; v1(65.23,31.71) 65.23,30.11 C59.1 ; v1(39.17,19.09) 40.07,19.99 C34.1 ; v1(39.17,49.57) 40.07,50.47 C38.1 ; v1(23.93,34.33) 24.83,35.23 C20.1 ; v1(19.51,54.57) 19.51,52.97 C14.1 ; C52.1 55.31,35.23 v1(54.41,34.33) ; v1(19.51,8.85) 19.51,7.25 C8.1 ; C35.1 40.07,27.61 v1(39.17,26.71) ; C23.1 24.83,58.09 v1(23.93,57.19) ; v1(49.99,8.85) 49.99,7.25 C40.1 ; v1(19.51,31.71) 19.51,30.11 C11.1 ; C17.1 24.83,12.37 v1(23.93,11.47) ; C26.1 34.75,14.87 v1(34.75,16.47) ; C33.1 40.07,12.37 v1(39.17,11.47) ; v1(34.75,54.57) 34.75,52.97 C30.1 ; v1(8.69,57.19) 9.59,58.09 C6.1 ; v1(39.17,3.85) 40.07,4.75 C32.1 ; C63.1 65.23,60.59 v1(65.23,62.19) ; C21.1 24.83,42.97 v1(23.97,42.11) ; v1(54.44,41.9) 55.31,42.77 C53.1 ; H1.1 3.81,36.45 4.95,37.59 4.95,39.5 7.24,41.78 8.52,41.78 v1(8.69,41.95) 9.59,42.85 C5.1 ; C29.1 34.75,45.35 v1(34.75,46.95) ; v1(34.75,39.33) 34.75,37.73 C24.1 ; C18.1 24.83,19.99 v1(23.93,19.09) ; v1(54.41,26.71) 55.31,27.61 C51.1 ; C49.1 55.31,12.37 v1(54.41,11.47) ; C0.1 9.59,4.75 v1(8.69,3.85) ; v1(34.75,62.19) 34.75,60.59 C31.1 ; v1(39.17,41.95) 40.07,42.85 C37.1 ; C50.1 55.31,19.99 v1(54.41,19.09) ; v1(54.41,49.57) 55.31,50.47 C54.1 ; C7.1 9.59,50.47 v1(8.69,49.57) ; v1(8.69,19.09) 9.59,19.99 C2.1 ; C13.1 19.51,45.35 v1(19.51,46.79)
DI: length 35.3
  Top Layer w0.254: 8.25,63.5 8.13,63.63 6.98,63.63 6.22,62.86 6.22,35.81 4.32,33.91 H1.2 ; 8.25,63.5 8.5,63.26 ; 8.25,63.5 8.5,63.5 8.5,63.26 ; LED0.4 8.69,63.07 8.5,63.26
DO: length 36.3
  Top Layer w0.254: v1(68.07,37.85) 68.07,61.59 66.04,63.63 63.46,63.63 LED63.2
  Bottom Layer w0.254: v1(68.07,37.85) 68.07,36.7 H2.2
$1N808: length 4.3
  Top Layer w0.254: LED0.2 10.58,55.88 10,55.88 LED1.4
$1N911: length 4.3
  Top Layer w0.254: LED1.2 10.58,48.26 10,48.26 LED2.4
$1N1014: length 4.3
  Top Layer w0.254: LED2.2 10.58,40.64 10,40.64 LED3.4
$1N1399: length 4.3
  Top Layer w0.254: LED4.4 10,33.02 10.58,33.02 LED3.2
$1N1408: length 4.3
  Top Layer w0.254: LED4.2 10.58,25.4 10,25.4 LED5.4
$1N1417: length 4.3
  Top Layer w0.254: LED5.2 10.58,17.78 10,17.78 LED6.4
$1N1426: length 4.3
  Top Layer w0.254: LED7.4 10,10.16 10.58,10.16 LED6.2
$1N2109: length 4.6
  Top Layer w0.254: LED9.4 19.51,11 18.54,10.03 17.78,10.03 16.6,8.85 LED8.2
$1N2122: length 4.3
  Top Layer w0.254: LED9.2 17.62,17.78 18.2,17.78 LED10.4
$1N2135: length 4.3
  Top Layer w0.254: LED10.2 17.74,25.53 18.32,25.53 LED11.4
$1N2175: length 4.3
  Top Layer w0.254: LED12.4 18.2,33.02 17.62,33.02 LED11.2
$1N2179: length 4.4
  Top Layer w0.254: LED13.4 19.51,41.73 18.29,40.51 17.49,40.51 LED12.2
$1N2183: length 4.3
  Top Layer w0.254: LED13.2 17.62,48.26 18.2,48.26 LED14.4
$1N2187: length 4.3
  Top Layer w0.254: LED14.2 17.62,55.88 18.29,55.88 19.51,57.1 LED15.4
$1N2875: length 4.3
  Top Layer w0.254: LED17.4 25.24,55.88 25.82,55.88 LED16.2
$1N2888: length 4.3
  Top Layer w0.254: LED17.2 25.82,48.26 25.24,48.26 LED18.4
$1N2901: length 4.3
  Top Layer w0.254: LED18.2 25.82,40.64 25.24,40.64 LED19.4
$1N2941: length 4.3
  Top Layer w0.254: LED20.4 25.24,33.02 25.82,33.02 LED19.2
$1N2945: length 4.3
  Top Layer w0.254: LED21.4 25.24,25.4 25.82,25.4 LED20.2
$1N2949: length 4.3
  Top Layer w0.254: LED21.2 25.82,17.78 25.24,17.78 LED22.4
$1N2953: length 4.3
  Top Layer w0.254: LED22.2 25.82,10.16 25.24,10.16 LED23.4
$1N3641: length 4.4
  Top Layer w0.254: LED25.4 34.75,11.25 33.53,10.03 32.73,10.03 LED24.2
$1N3654: length 4.3
  Top Layer w0.254: LED25.2 32.98,17.91 33.56,17.91 LED26.4
$1N3667: length 4.3
  Top Layer w0.254: LED26.2 32.73,25.27 33.4,25.27 34.75,26.62 LED27.4
$1N3707: length 4.3
  Top Layer w0.254: LED27.2 32.73,32.89 33.4,32.89 34.75,34.24 LED28.4
$1N3711: length 4.3
  Top Layer w0.254: LED28.2 32.98,40.77 33.56,40.77 LED29.4
$1N3715: length 4.5
  Top Layer w0.254: LED29.2 32.6,48.01 33.53,48.01 34.75,49.22 LED30.4
$1N3719: length 4.7
  Top Layer w0.254: LED31.4 34.75,56.46 33.78,55.5 32.48,55.5 LED30.2
$1N4407: length 4.3
  Top Layer w0.254: LED33.4 40.35,55.75 40.93,55.75 LED32.2
$1N4420: length 4.4
  Top Layer w0.254: LED33.2 41.18,48.39 40.39,48.39 39.17,47.17 LED34.4
$1N4433: length 4.3
  Top Layer w0.254: LED35.4 39.17,39.42 40.39,40.64 41.06,40.64 LED34.2
$1N4473: length 4.3
  Top Layer w0.254: LED36.4 40.48,33.02 41.06,33.02 LED35.2
$1N4477: length 4.3
  Top Layer w0.254: LED36.2 41.06,25.4 40.48,25.4 LED37.4
$1N4481: length 4.3
  Top Layer w0.254: LED37.2 40.93,17.65 40.26,17.65 39.17,16.56 LED38.4
$1N4485: length 4.3
  Top Layer w0.254: LED39.4 40.48,10.16 41.06,10.16 LED38.2
$1N5173: length 4.4
  Top Layer w0.254: LED40.2 48.1,10.16 48.9,10.16 49.99,11.25 LED41.4
$1N5186: length 4.3
  Top Layer w0.254: LED41.2 47.97,17.65 48.55,17.65 LED42.4
$1N5199: length 4.6
  Top Layer w0.254: LED43.4 49.99,26.24 49.02,25.27 47.97,25.27 LED42.2
$1N5239: length 4.3
  Top Layer w0.254: LED43.2 47.97,32.89 48.55,32.89 LED44.4
$1N5243: length 4.5
  Top Layer w0.254: LED45.4 49.99,41.61 49.02,40.64 48.1,40.64 LED44.2
$1N5247: length 4.4
  Top Layer w0.254: LED45.2 48.1,48.26 48.9,48.26 49.99,49.35 LED46.4
$1N5251: length 4.5
  Top Layer w0.254: LED47.4 49.99,56.84 48.77,55.63 47.84,55.63 LED46.2
$1N5939: length 4.3
  Top Layer w0.254: LED49.4 54.57,54.57 55.88,55.88 56.3,55.88 LED48.2
$1N5952: length 4.3
  Top Layer w0.254: LED50.4 55.84,48.39 56.42,48.39 LED49.2
$1N5965: length 4.4
  Top Layer w0.254: LED50.2 56.3,40.64 55.5,40.64 54.41,39.55 LED51.4
$1N6005: length 4.4
  Top Layer w0.254: LED52.4 54.41,31.93 55.37,32.89 56.17,32.89 LED51.2
$1N6009: length 4.3
  Top Layer w0.254: LED52.2 56.17,25.27 55.75,25.27 54.57,24.09 LED53.4
$1N6013: length 4.3
  Top Layer w0.254: LED54.4 55.46,17.53 56.04,17.53 LED53.2
$1N6017: length 4.4
  Top Layer w0.254: LED54.2 56.42,10.29 55.63,10.29 54.41,9.07 LED55.4
$1N6705: length 4.5
  Top Layer w0.254: LED56.2 63.08,9.91 64.01,9.91 65.23,11.12 LED57.4
$1N6718: length 4.6
  Top Layer w0.254: LED57.2 63.08,17.53 64.26,17.53 65.23,18.49 LED58.4
$1N6731: length 4.6
  Top Layer w0.254: LED59.4 65.23,26.24 64.14,25.15 63.08,25.15 LED58.2
$1N6771: length 4.4
  Top Layer w0.254: LED59.2 63.34,33.02 64.14,33.02 65.23,34.11 LED60.4
$1N6775: length 4.3
  Top Layer w0.254: LED61.4 63.92,40.64 63.34,40.64 LED60.2
$1N6779: length 4.5
  Top Layer w0.254: LED62.4 65.23,49.22 64.14,48.13 63.21,48.13 LED61.2
$1N6783: length 4.3
  Top Layer w0.254: LED63.4 65.23,57.1 64.01,55.88 63.34,55.88 LED62.2
$1N6797: length 8.9
  Top Layer w0.254: LED8.4 17.94,2.29 13.45,2.29 LED7.2
$1N6803: length 9
  Top Layer w0.254: LED16.4 23.93,62.31 22.48,63.75 17.87,63.75 LED15.2
$1N6809: length 8.7
  Top Layer w0.254: LED24.4 34.71,3.85 33.4,2.54 28.44,2.54 LED23.2
$1N6815: length 9.1
  Top Layer w0.254: LED32.4 39.17,62.31 37.59,63.88 33.24,63.88 LED31.2
$1N6821: length 8.7
  Top Layer w0.254: LED39.2 43.68,2.54 48.51,2.54 49.82,3.85 LED40.4
$1N6832: length 8.6
  Top Layer w0.254: LED47.2 47.97,63.37 52.83,63.37 54.02,62.19 LED48.4
$1N6838: length 8.9
  Top Layer w0.254: LED55.2 59.17,2.29 63.66,2.29 LED56.4

## Copper pours and planes (outline as drawn; the poured copper is in the pictures)
GND on Top Layer: 0,65.15 73.15,65.15 73.15,0 0,0
GND on Bottom Layer: 0,65.15 73.15,65.15 73.15,0 0,0
